# Altium schematic sheet Air quality sensor.SchDoc
size A4
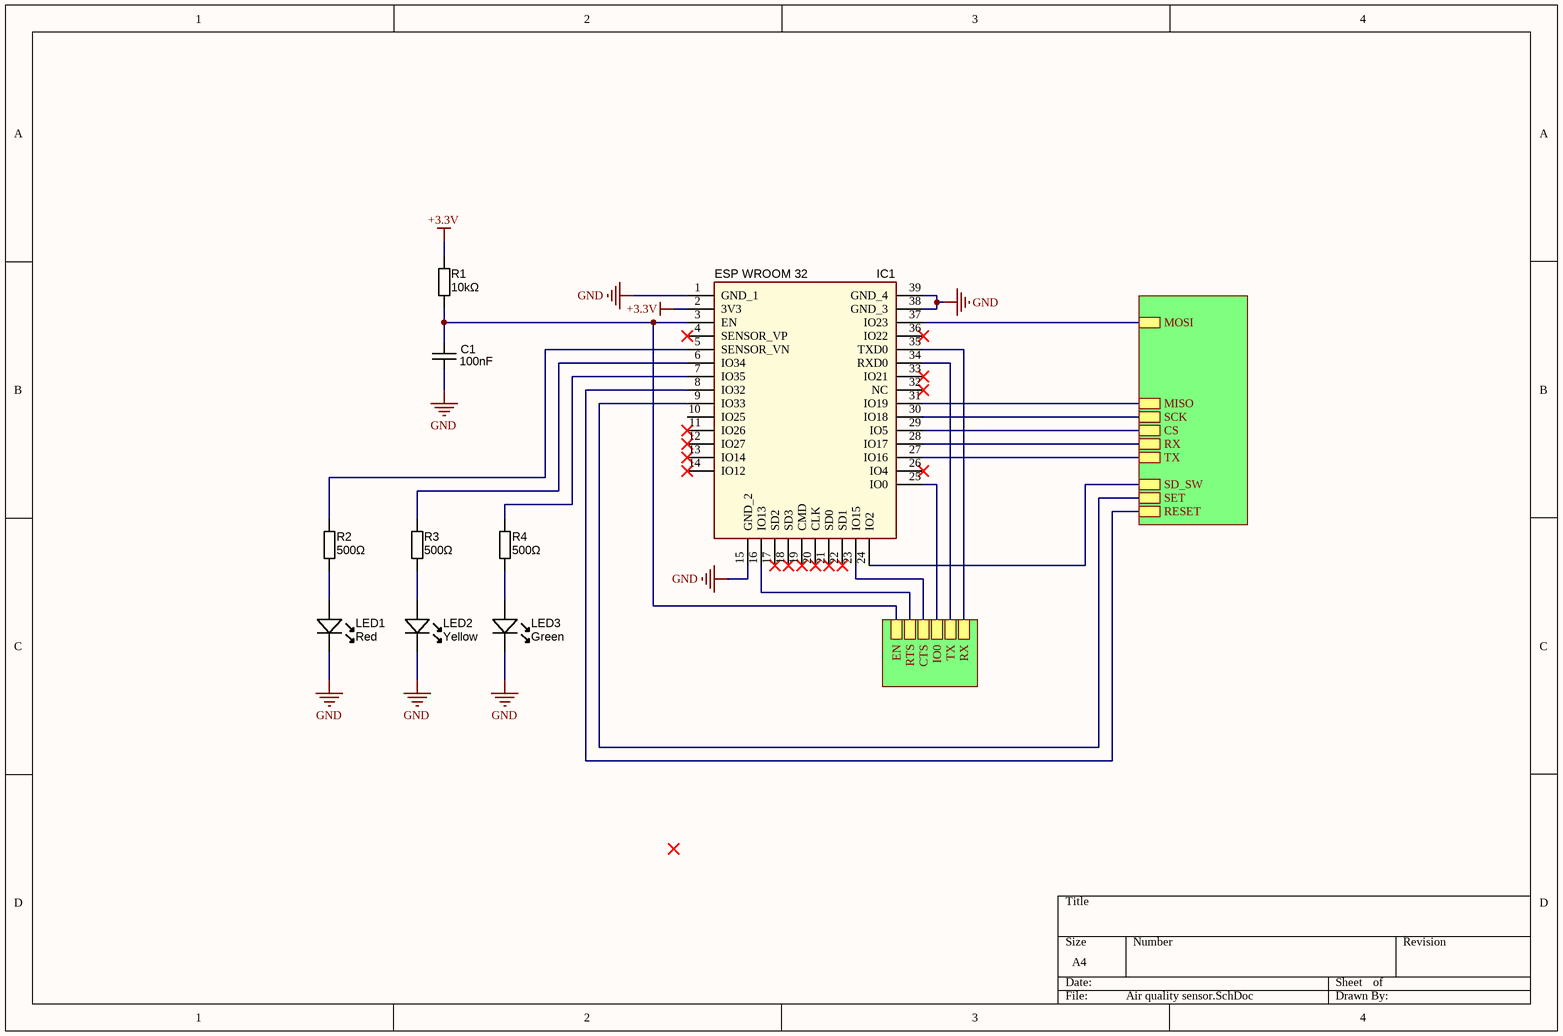
[diagram p0: Air quality sensor.SchDoc]

## Parts
C1  value 100nF  [CAPC1608N]  (hidden comment: approved sub OK)
IC1  ESP WROOM 32  [ESP32WROOM32D]
LED1  Red  [LED-0603-WHITE]
LED2  Yellow  [LED-0603-WHITE]
LED3  Green  [LED-0603-WHITE]
R1  value 10kΩ  [RESC1608N]  (hidden comment: Thick Film)
R2  value 500Ω  [RESC1608N]  (hidden comment: Thick Film)
R3  value 500Ω  [RESC1608N]  (hidden comment: Thick Film)
R4  value 500Ω  [RESC1608N]  (hidden comment: Thick Film)

## Sub-sheets
U_Air sensor, SD card = Air sensor, SD card.SchDoc: SD_SW, MISO, SCK, MOSI, CS, RX, TX, SET, RESET
U_Power managment = Power managment.SchDoc: no entries
U_USB module = USB module.SchDoc: CTS, IO0, RTS, TX, RX, EN

## Nets
+3.3V: IC1.2(3V3) R1.1
GND: C1.1 IC1.1(GND_1) IC1.15(GND_2) IC1.38(GND_3) IC1.39(GND_4) LED1.K LED2.K LED3.K
NetC1_2: C1.2 IC1.3(EN) R1.2 ; sheet U_USB module/EN
NetIC1_5: IC1.5(SENSOR_VN) R2.1
NetIC1_6: IC1.6(IO34) R3.1
NetIC1_7: IC1.7(IO35) R4.1
NetIC1_8: IC1.8(IO32) ; sheet U_Air sensor, SD card/RESET
NetIC1_9: IC1.9(IO33) ; sheet U_Air sensor, SD card/SET
NetIC1_16: IC1.16(IO13) ; sheet U_USB module/RTS
NetIC1_23: IC1.23(IO15) ; sheet U_USB module/CTS
NetIC1_24: IC1.24(IO2) ; sheet U_Air sensor, SD card/SD_SW
NetIC1_25: IC1.25(IO0) ; sheet U_USB module/IO0
NetIC1_27: IC1.27(IO16) ; sheet U_Air sensor, SD card/TX
NetIC1_28: IC1.28(IO17) ; sheet U_Air sensor, SD card/RX
NetIC1_29: IC1.29(IO5) ; sheet U_Air sensor, SD card/CS
NetIC1_30: IC1.30(IO18) ; sheet U_Air sensor, SD card/SCK
NetIC1_31: IC1.31(IO19) ; sheet U_Air sensor, SD card/MISO
NetIC1_34: IC1.34(RXD0) ; sheet U_USB module/TX
NetIC1_35: IC1.35(TXD0) ; sheet U_USB module/RX
NetIC1_37: IC1.37(IO23) ; sheet U_Air sensor, SD card/MOSI
NetLED1_A: LED1.A R2.2
NetLED2_A: LED2.A R3.2
NetLED3_A: LED3.A R4.2

Not connected (* = marked no-connect by the designer): IC1 4(SENSOR_VP)* 10(IO25) 11(IO26)* 12(IO27)* 13(IO14)* 14(IO12)* 17(SD2)* 18(SD3)* 19(CMD)* 20(CLK)* 21(SD0)* 22(SD1)* 26(IO4)* 32(NC)* 33(IO21)* 36(IO22)*

## Library data of the parts
C1 = CAPC_1u_0603: Capacitor SMD Cer 1uF 10% 16V X7R 0603; Manufacturer 1: TDK Corporation; Manufacturer Part Number 1: C1608X7R1C105K; Ratings: 16V; X7R; Material: ceramic; Package / Case: 0603 (1608 metric); Tolerance: ±10%; Supplier 1: Digi-Key; Supplier Part Number 1: 445-1604-1-ND
IC1 = ESP-WROOM-32__16MB_: Integrated Circuit; Manufacturer_Name: Espressif; Manufacturer_Part_Number: ESP-WROOM-32 (16MB); Datasheet Link: https://www.mouser.com/datasheet/2/891/esp-wroom-32_datasheet_en-1365813.pdf; Height: 3.1mm; Mouser Part Number: 356-ESPWROOM3216MB
LED1-LED3 = LED_SMD_White_0603_109mcd: LED 0603 SMD White 8700K 108.5mcd 5mA; Manufacturer 1: Lite-On Inc; Manufacturer Part Number 1: LTW-C193TS5; Material: InGaN; Ratings: 108.5 mcd; 8700K; Millicandela Rating: 230mcd; Voltage - Forward (Vf) Typ: 3.3V; Current - Test: 20mA; Viewing Angle: 120°; Lens Type: Clear, Tinted; Lens Style/Size: Rectangle with Flat Top, 0.8mm x 1.1mm; Voltage - Forward (Vf) @ 10mA: 3.0V; Package / Case: 0603 (1608 metric); Supplier 1: Digi-Key; Supplier Part Number 1: 160-1721-1-ND; Supplier 2: Digi-Key; Supplier Part Number 2: APT1608QWF/D-ND; Manufacturer 2: Kingbright Corp; Manufacturer Part Number 2: APT1608QWF/D; Color: White; Size / Dimension: 1.60mm L x 0.80mm W; Mounting Type: Surface Mount; Luminous Flux @ Current - Test: -; ComponentLink2URL: http://www.kingbrightusa.com/images/catalog/SPEC/APT1608QWF-D.pdf; ComponentLink2Description: APT1608QWF-D Datasheet
R1-R4 = RES_1K5_0603_5%: Resistor SMD chip 1.5k Ohm 0.1W 5% 0603; Manufacturer 1: Yageo; Manufacturer Part Number 1: RC0603JR-071K5L; Ratings: 1/10 W; Package / Case: 0603 (1608 metric); Tolerance: ±5%; Material: thick film; Supplier 1: Digi-Key; Supplier Part Number 1: 311-1.5KGRCT-ND